# Altium schematic sheet SAM_Dispenser_1.SchDoc
size A4; SheetNumber: 1; SheetTotal: 2
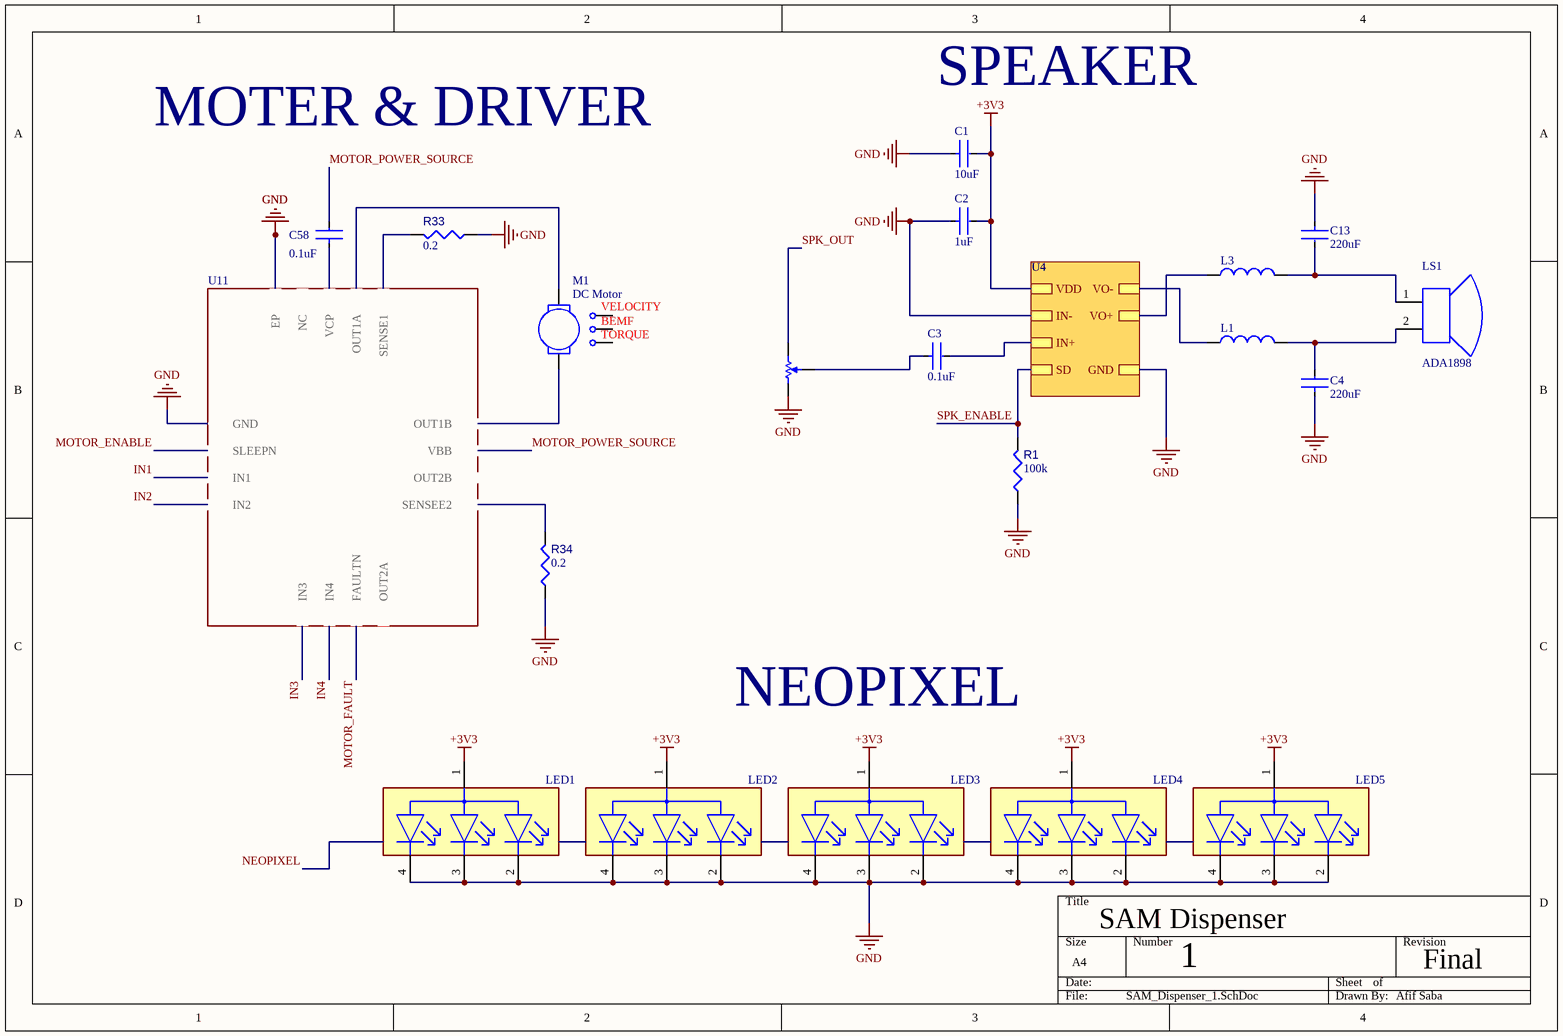
[diagram p0: SAM_Dispenser_1.SchDoc]

## Parts
C1  Parameter 1: 10uF  [4.7uF400V]  (hidden comment: 475CKE400M)
C2  Parameter 1: 1uF  [4.7uF400V]  (hidden comment: 475CKE400M)
C3  Parameter 1: 0.1uF  [4.7uF400V]  (hidden comment: 475CKE400M)
C4  Parameter 1: 220uF  [4.7uF400V]  (hidden comment: 475CKE400M)
C13  Parameter 1: 220uF  [4.7uF400V]  (hidden comment: 475CKE400M)
C58  Parameter 1: 0.1uF  [4.7uF400V]  (hidden comment: 475CKE400M)
L1  Inductor47pH  [WE-PD 1050]  (value not drawn)
L3  Inductor47pH  [WE-PD 1050]  (value not drawn)
LED1  SML-LX0404SIUPGUSB  [FP-SML-LX0404SIUPGUSB-MFG]  (value not drawn)
LED2  SML-LX0404SIUPGUSB  [FP-SML-LX0404SIUPGUSB-MFG]  (value not drawn)
LED3  SML-LX0404SIUPGUSB  [FP-SML-LX0404SIUPGUSB-MFG]  (value not drawn)
LED4  SML-LX0404SIUPGUSB  [FP-SML-LX0404SIUPGUSB-MFG]  (value not drawn)
LED5  SML-LX0404SIUPGUSB  [FP-SML-LX0404SIUPGUSB-MFG]  (value not drawn)
LS1  ADA1898  [ADAI-ADA1898]
M1  DC Motor
R1  value 100k  [RESC0402(1005)_L]  (hidden comment: 3KR2F)
R2  TC33X-2-103E  [BOUR-TC33X-2_V]  (value not drawn)
R33  R34: 0.2  [RESC0402(1005)_L]  (hidden comment: 3KR2F)
R34  R34: 0.2  [RESC0402(1005)_L]  (hidden comment: 3KR2F)

## Sub-sheets
U11 = File Name: GND (bidir), SLEEPN, IN1, IN2, OUT1B, VBB, OUT2B, SENSEE2, IN3, IN4, FAULTN, OUT2A, EP, NC, VCP, OUT1A, SENSE1
? = U4: VDD, VO-, VO+, IN-, IN+, SD, GND

## Nets
+3V3: C1.2 C2.2 LED1.1(Common_Anode) LED2.1(Common_Anode) LED3.1(Common_Anode) LED4.1(Common_Anode) LED5.1(Common_Anode) ; sheet /VDD
GND: C1.1 C2.1 C4.1 C13.1 LED1.2(Red_C) LED1.3(Blue_C) LED1.4(Green_C) LED2.2(Red_C) LED2.3(Blue_C) LED2.4(Green_C) LED3.2(Red_C) LED3.3(Blue_C) LED3.4(Green_C) LED4.2(Red_C) LED4.3(Blue_C) LED4.4(Green_C) LED5.2(Red_C) LED5.3(Blue_C) LED5.4(Green_C) R1.1 R2.1 R33.1 R34.1 ; sheet /IN-, sheet /GND, sheet U11/GND, sheet U11/EP
IN1: sheet U11/IN1
IN2: sheet U11/IN2
IN3: sheet U11/IN3
IN4: sheet U11/IN4
MOTOR_ENABLE: sheet U11/SLEEPN
MOTOR_FAULT: sheet U11/FAULTN
MOTOR_POWER_SOURCE: C58.2 ; sheet U11/VBB
SPK_ENABLE: R1.2 ; sheet /SD
SPK_OUT: R2.3
NetC3_1: C3.1 R2.2
NetC3_2: C3.2 ; sheet /IN+
NetC4_2: C4.2 L1.2 LS1.2(-)
NetC13_2: C13.2 L3.2 LS1.1(+)
NetC58_1: C58.1 ; sheet U11/VCP
NetL1_1: L1.1 ; sheet /VO-
NetL3_1: L3.1 ; sheet /VO+
NetM1_1: M1.1 ; sheet U11/OUT1A
NetM1_2: M1.2 ; sheet U11/OUT1B
NetR33_2: R33.2 ; sheet U11/SENSE1
NetR34_2: R34.2 ; sheet U11/SENSEE2

Not connected (* = marked no-connect by the designer): M1 3 4 5

## Notes on the sheet
- SPEAKER
- MOTER & DRIVER
- NEOPIXEL
- SAM Dispenser
- 1
- Final
- Afif Saba
- (in symbol DC Motor) VELOCITY; BEMF; TORQUE

## Library data of the parts
C1-C4 C13 C58 = CMP-003-000022-1: 4.7 µF 400 V Aluminum Electrolytic Capacitors Radial, Can 70.547Ohm @ 120Hz 2000 Hrs @ 105°C; Parameter 2: 00V; Source: NewVoltageReg.SCHLIB; Design Item ID: 475CKE400M
L1 L3 = CMP-004-000001-1: Value: 47 uH; Design Item ID: Inductor47pH; Source: VoltageSchematic.SCHLIB
LED1-LED5 = CMP-2000-07119-2: LED RGB CLEAR SMD; Test Current: 2mA; Wavelength: 465nm; Color: Blue; Lens Style: Square; Power Rating: 30mW; Lens Color: Colorless; Number of LEDs: 3; Viewing Angle: 120°; Luminous Intensity: 20mcd; Forward Voltage: 2.73V; Height: 0.3mm; Lead Free: Lead Free; Max Operating Temperature: 85°C; Mount: Surface Mount; REACH SVHC: No SVHC; Case Code (Imperial): 0404; Forward Current: 2mA; Case Code (Metric): 1010; Lens Transparency: Clear; Length: 1mm; Packaging: Tape and Reel; Min Operating Temperature: -40°C; Package Quantity: 2000; Case/Package: 0404; Width: 1mm
LS1 = CMP-00027-00000-1: Mini Speaker, 8 Ohm, 0.2 Wmax, -10 to 40 degC, 2-Pin THD, RoHS; Manufacturer: Adafruit Industries; Mounting Technology: TH; Datasheet URL: https://cdn-shop.adafruit.com/datasheets/P1898.pdf; Package Description: 2-Pin Through Hole Device, Dia 29.3 mm, Pitch 15 mm; Case/Package: ADA1898; Package Reference: ADA1898; Datasheet Version: Mar-14; Manufacturer URL: https://www.adafruit.com/; RoHS Compliant: Unknown
M1 = DC Motor: LA: 1.5M; RA: 0.5; KE: 0.05; JM: 250U; BM: 0.1M; TL: 0; SimulationGenericComponent: True; KT: 0.05
R1 R33 R34 = CMP-009-00099-1: 3K 0.063W 1% 0402 (1005 Metric)  SMD; Power: 63mW; Tolerance: 1%; Pins: 2; Case/Package: 0402; Mounting Technology: SMT
R2 = CMP-009-00060-1: Trimming Potentiometer, 10000 Ohm, -40 to 100 degC, 3-Pin SMD, RoHS, Tape and Reel; Manufacturer: Bourns; Power: 100mW; Tolerance: 25%; Resistance: 10k; Package Description: 3-Pin Surface Mount Device, Body 3.8 x 3.6 mm; Case/Package: TC33X-2; Datasheet Version: Aug-16; Manufacturer URL: http://www.bourns.com/; Min Operating Temperature: -40°C; Datasheet URL: http://www.bourns.com/docs/Product-Datasheets/TC33.pdf; Package Reference: TC33X-2; Packaging: TapeandReel; Composition: Potentiometer; Package Quantity: 2500; Max Operating Temperature: 120°C; RoHS Compliant: True; Mounting Technology: SM